# Altium schematic sheet LED´s_1Teclado.SchDoc
size A4
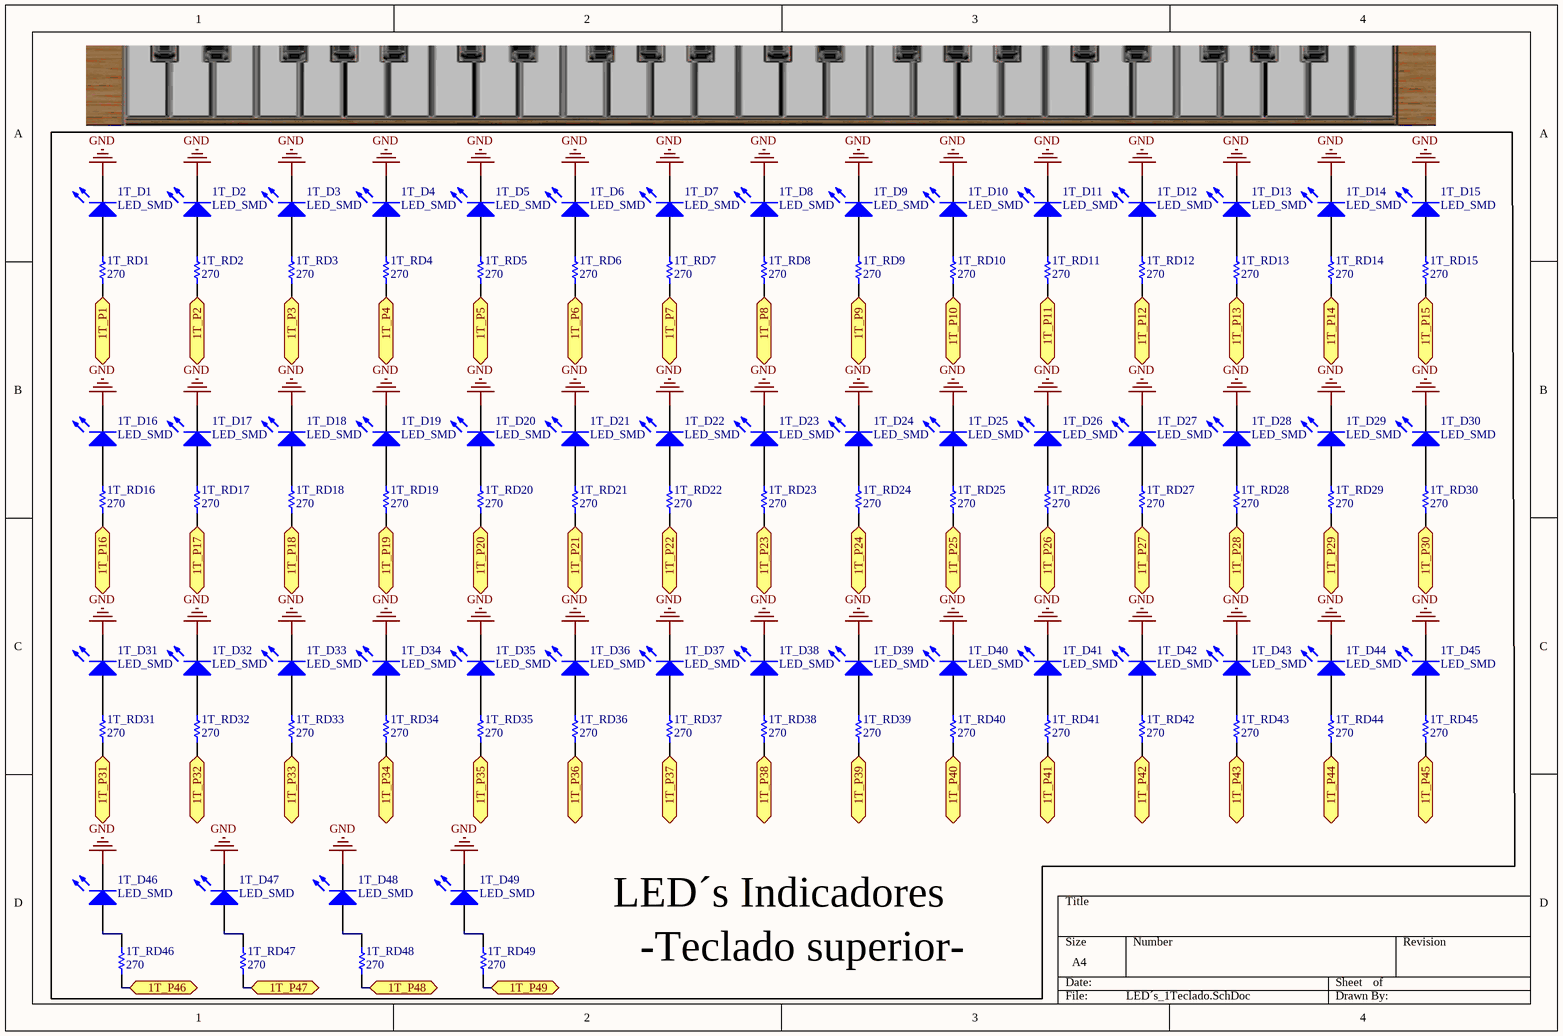
[diagram p0: LED´s_1Teclado.SchDoc]

## Parts
1T_D1  LED_SMD  [0805]
1T_D2  LED_SMD  [0805]
1T_D3  LED_SMD  [0805]
1T_D4  LED_SMD  [0805]
1T_D5  LED_SMD  [0805]
1T_D6  LED_SMD  [0805]
1T_D7  LED_SMD  [0805]
1T_D8  LED_SMD  [0805]
1T_D9  LED_SMD  [0805]
1T_D10  LED_SMD  [0805]
1T_D11  LED_SMD  [0805]
1T_D12  LED_SMD  [0805]
1T_D13  LED_SMD  [0805]
1T_D14  LED_SMD  [0805]
1T_D15  LED_SMD  [0805]
1T_D16  LED_SMD  [0805]
1T_D17  LED_SMD  [0805]
1T_D18  LED_SMD  [0805]
1T_D19  LED_SMD  [0805]
1T_D20  LED_SMD  [0805]
1T_D21  LED_SMD  [0805]
1T_D22  LED_SMD  [0805]
1T_D23  LED_SMD  [0805]
1T_D24  LED_SMD  [0805]
1T_D25  LED_SMD  [0805]
1T_D26  LED_SMD  [0805]
1T_D27  LED_SMD  [0805]
1T_D28  LED_SMD  [0805]
1T_D29  LED_SMD  [0805]
1T_D30  LED_SMD  [0805]
1T_D31  LED_SMD  [0805]
1T_D32  LED_SMD  [0805]
1T_D33  LED_SMD  [0805]
1T_D34  LED_SMD  [0805]
1T_D35  LED_SMD  [0805]
1T_D36  LED_SMD  [0805]
1T_D37  LED_SMD  [0805]
1T_D38  LED_SMD  [0805]
1T_D39  LED_SMD  [0805]
1T_D40  LED_SMD  [0805]
1T_D41  LED_SMD  [0805]
1T_D42  LED_SMD  [0805]
1T_D43  LED_SMD  [0805]
1T_D44  LED_SMD  [0805]
1T_D45  LED_SMD  [0805]
1T_D46  LED_SMD  [0805]
1T_D47  LED_SMD  [0805]
1T_D48  LED_SMD  [0805]
1T_D49  LED_SMD  [0805]
1T_RD1  value 270  [0805 Chip Res]  (hidden comment: Res Chip 0805)
1T_RD2  value 270  [0805 Chip Res]  (hidden comment: Res Chip 0805)
1T_RD3  value 270  [0805 Chip Res]  (hidden comment: Res Chip 0805)
1T_RD4  value 270  [0805 Chip Res]  (hidden comment: Res Chip 0805)
1T_RD5  value 270  [0805 Chip Res]  (hidden comment: Res Chip 0805)
1T_RD6  value 270  [0805 Chip Res]  (hidden comment: Res Chip 0805)
1T_RD7  value 270  [0805 Chip Res]  (hidden comment: Res Chip 0805)
1T_RD8  value 270  [0805 Chip Res]  (hidden comment: Res Chip 0805)
1T_RD9  value 270  [0805 Chip Res]  (hidden comment: Res Chip 0805)
1T_RD10  value 270  [0805 Chip Res]  (hidden comment: Res Chip 0805)
1T_RD11  value 270  [0805 Chip Res]  (hidden comment: Res Chip 0805)
1T_RD12  value 270  [0805 Chip Res]  (hidden comment: Res Chip 0805)
1T_RD13  value 270  [0805 Chip Res]  (hidden comment: Res Chip 0805)
1T_RD14  value 270  [0805 Chip Res]  (hidden comment: Res Chip 0805)
1T_RD15  value 270  [0805 Chip Res]  (hidden comment: Res Chip 0805)
1T_RD16  value 270  [0805 Chip Res]  (hidden comment: Res Chip 0805)
1T_RD17  value 270  [0805 Chip Res]  (hidden comment: Res Chip 0805)
1T_RD18  value 270  [0805 Chip Res]  (hidden comment: Res Chip 0805)
1T_RD19  value 270  [0805 Chip Res]  (hidden comment: Res Chip 0805)
1T_RD20  value 270  [0805 Chip Res]  (hidden comment: Res Chip 0805)
1T_RD21  value 270  [0805 Chip Res]  (hidden comment: Res Chip 0805)
1T_RD22  value 270  [0805 Chip Res]  (hidden comment: Res Chip 0805)
1T_RD23  value 270  [0805 Chip Res]  (hidden comment: Res Chip 0805)
1T_RD24  value 270  [0805 Chip Res]  (hidden comment: Res Chip 0805)
1T_RD25  value 270  [0805 Chip Res]  (hidden comment: Res Chip 0805)
1T_RD26  value 270  [0805 Chip Res]  (hidden comment: Res Chip 0805)
1T_RD27  value 270  [0805 Chip Res]  (hidden comment: Res Chip 0805)
1T_RD28  value 270  [0805 Chip Res]  (hidden comment: Res Chip 0805)
1T_RD29  value 270  [0805 Chip Res]  (hidden comment: Res Chip 0805)
1T_RD30  value 270  [0805 Chip Res]  (hidden comment: Res Chip 0805)
1T_RD31  value 270  [0805 Chip Res]  (hidden comment: Res Chip 0805)
1T_RD32  value 270  [0805 Chip Res]  (hidden comment: Res Chip 0805)
1T_RD33  value 270  [0805 Chip Res]  (hidden comment: Res Chip 0805)
1T_RD34  value 270  [0805 Chip Res]  (hidden comment: Res Chip 0805)
1T_RD35  value 270  [0805 Chip Res]  (hidden comment: Res Chip 0805)
1T_RD36  value 270  [0805 Chip Res]  (hidden comment: Res Chip 0805)
1T_RD37  value 270  [0805 Chip Res]  (hidden comment: Res Chip 0805)
1T_RD38  value 270  [0805 Chip Res]  (hidden comment: Res Chip 0805)
1T_RD39  value 270  [0805 Chip Res]  (hidden comment: Res Chip 0805)
1T_RD40  value 270  [0805 Chip Res]  (hidden comment: Res Chip 0805)
1T_RD41  value 270  [0805 Chip Res]  (hidden comment: Res Chip 0805)
1T_RD42  value 270  [0805 Chip Res]  (hidden comment: Res Chip 0805)
1T_RD43  value 270  [0805 Chip Res]  (hidden comment: Res Chip 0805)
1T_RD44  value 270  [0805 Chip Res]  (hidden comment: Res Chip 0805)
1T_RD45  value 270  [0805 Chip Res]  (hidden comment: Res Chip 0805)
1T_RD46  value 270  [0805 Chip Res]  (hidden comment: Res Chip 0805)
1T_RD47  value 270  [0805 Chip Res]  (hidden comment: Res Chip 0805)
1T_RD48  value 270  [0805 Chip Res]  (hidden comment: Res Chip 0805)
1T_RD49  value 270  [0805 Chip Res]  (hidden comment: Res Chip 0805)

## Ports
1T_P1, 1T_P2, 1T_P3, 1T_P4, 1T_P5, 1T_P6, 1T_P7, 1T_P8, 1T_P9, 1T_P10, 1T_P11, 1T_P12, 1T_P13, 1T_P14, 1T_P15, 1T_P16, 1T_P17, 1T_P18, 1T_P19, 1T_P20, 1T_P21, 1T_P22, 1T_P23, 1T_P24, 1T_P25, 1T_P26, 1T_P27, 1T_P28, 1T_P29, 1T_P30, 1T_P31, 1T_P32, 1T_P33, 1T_P34, 1T_P35, 1T_P36, 1T_P37, 1T_P38, 1T_P39, 1T_P40, 1T_P41, 1T_P42, 1T_P43, 1T_P44, 1T_P45, 1T_P46, 1T_P47, 1T_P48, 1T_P49

## Nets
GND: 1T_D1.2(K) 1T_D2.2(K) 1T_D3.2(K) 1T_D4.2(K) 1T_D5.2(K) 1T_D6.2(K) 1T_D7.2(K) 1T_D8.2(K) 1T_D9.2(K) 1T_D10.2(K) 1T_D11.2(K) 1T_D12.2(K) 1T_D13.2(K) 1T_D14.2(K) 1T_D15.2(K) 1T_D16.2(K) 1T_D17.2(K) 1T_D18.2(K) 1T_D19.2(K) 1T_D20.2(K) 1T_D21.2(K) 1T_D22.2(K) 1T_D23.2(K) 1T_D24.2(K) 1T_D25.2(K) 1T_D26.2(K) 1T_D27.2(K) 1T_D28.2(K) 1T_D29.2(K) 1T_D30.2(K) 1T_D31.2(K) 1T_D32.2(K) 1T_D33.2(K) 1T_D34.2(K) 1T_D35.2(K) 1T_D36.2(K) 1T_D37.2(K) 1T_D38.2(K) 1T_D39.2(K) 1T_D40.2(K) 1T_D41.2(K) 1T_D42.2(K) 1T_D43.2(K) 1T_D44.2(K) 1T_D45.2(K) 1T_D46.2(K) 1T_D47.2(K) 1T_D48.2(K) 1T_D49.2(K)
1T_P1: 1T_RD1.1 ; port 1T_P1
1T_P2: 1T_RD2.1 ; port 1T_P2
1T_P3: 1T_RD3.1 ; port 1T_P3
1T_P4: 1T_RD4.1 ; port 1T_P4
1T_P5: 1T_RD5.1 ; port 1T_P5
1T_P6: 1T_RD6.1 ; port 1T_P6
1T_P7: 1T_RD7.1 ; port 1T_P7
1T_P8: 1T_RD8.1 ; port 1T_P8
1T_P9: 1T_RD9.1 ; port 1T_P9
1T_P10: 1T_RD10.1 ; port 1T_P10
1T_P11: 1T_RD11.1 ; port 1T_P11
1T_P12: 1T_RD12.1 ; port 1T_P12
1T_P13: 1T_RD13.1 ; port 1T_P13
1T_P14: 1T_RD14.1 ; port 1T_P14
1T_P15: 1T_RD15.1 ; port 1T_P15
1T_P16: 1T_RD16.1 ; port 1T_P16
1T_P17: 1T_RD17.1 ; port 1T_P17
1T_P18: 1T_RD18.1 ; port 1T_P18
1T_P19: 1T_RD19.1 ; port 1T_P19
1T_P20: 1T_RD20.1 ; port 1T_P20
1T_P21: 1T_RD21.1 ; port 1T_P21
1T_P22: 1T_RD22.1 ; port 1T_P22
1T_P23: 1T_RD23.1 ; port 1T_P23
1T_P24: 1T_RD24.1 ; port 1T_P24
1T_P25: 1T_RD25.1 ; port 1T_P25
1T_P26: 1T_RD26.1 ; port 1T_P26
1T_P27: 1T_RD27.1 ; port 1T_P27
1T_P28: 1T_RD28.1 ; port 1T_P28
1T_P29: 1T_RD29.1 ; port 1T_P29
1T_P30: 1T_RD30.1 ; port 1T_P30
1T_P31: 1T_RD31.1 ; port 1T_P31
1T_P32: 1T_RD32.1 ; port 1T_P32
1T_P33: 1T_RD33.1 ; port 1T_P33
1T_P34: 1T_RD34.1 ; port 1T_P34
1T_P35: 1T_RD35.1 ; port 1T_P35
1T_P36: 1T_RD36.1 ; port 1T_P36
1T_P37: 1T_RD37.1 ; port 1T_P37
1T_P38: 1T_RD38.1 ; port 1T_P38
1T_P39: 1T_RD39.1 ; port 1T_P39
1T_P40: 1T_RD40.1 ; port 1T_P40
1T_P41: 1T_RD41.1 ; port 1T_P41
1T_P42: 1T_RD42.1 ; port 1T_P42
1T_P43: 1T_RD43.1 ; port 1T_P43
1T_P44: 1T_RD44.1 ; port 1T_P44
1T_P45: 1T_RD45.1 ; port 1T_P45
1T_P46: 1T_RD46.1 ; port 1T_P46
1T_P47: 1T_RD47.1 ; port 1T_P47
1T_P48: 1T_RD48.1 ; port 1T_P48
1T_P49: 1T_RD49.1 ; port 1T_P49
Net1T_D1_1: 1T_D1.1(A) 1T_RD1.2
Net1T_D2_1: 1T_D2.1(A) 1T_RD2.2
Net1T_D3_1: 1T_D3.1(A) 1T_RD3.2
Net1T_D4_1: 1T_D4.1(A) 1T_RD4.2
Net1T_D5_1: 1T_D5.1(A) 1T_RD5.2
Net1T_D6_1: 1T_D6.1(A) 1T_RD6.2
Net1T_D7_1: 1T_D7.1(A) 1T_RD7.2
Net1T_D8_1: 1T_D8.1(A) 1T_RD8.2
Net1T_D9_1: 1T_D9.1(A) 1T_RD9.2
Net1T_D10_1: 1T_D10.1(A) 1T_RD10.2
Net1T_D11_1: 1T_D11.1(A) 1T_RD11.2
Net1T_D12_1: 1T_D12.1(A) 1T_RD12.2
Net1T_D13_1: 1T_D13.1(A) 1T_RD13.2
Net1T_D14_1: 1T_D14.1(A) 1T_RD14.2
Net1T_D15_1: 1T_D15.1(A) 1T_RD15.2
Net1T_D16_1: 1T_D16.1(A) 1T_RD16.2
Net1T_D17_1: 1T_D17.1(A) 1T_RD17.2
Net1T_D18_1: 1T_D18.1(A) 1T_RD18.2
Net1T_D19_1: 1T_D19.1(A) 1T_RD19.2
Net1T_D20_1: 1T_D20.1(A) 1T_RD20.2
Net1T_D21_1: 1T_D21.1(A) 1T_RD21.2
Net1T_D22_1: 1T_D22.1(A) 1T_RD22.2
Net1T_D23_1: 1T_D23.1(A) 1T_RD23.2
Net1T_D24_1: 1T_D24.1(A) 1T_RD24.2
Net1T_D25_1: 1T_D25.1(A) 1T_RD25.2
Net1T_D26_1: 1T_D26.1(A) 1T_RD26.2
Net1T_D27_1: 1T_D27.1(A) 1T_RD27.2
Net1T_D28_1: 1T_D28.1(A) 1T_RD28.2
Net1T_D29_1: 1T_D29.1(A) 1T_RD29.2
Net1T_D30_1: 1T_D30.1(A) 1T_RD30.2
Net1T_D31_1: 1T_D31.1(A) 1T_RD31.2
Net1T_D32_1: 1T_D32.1(A) 1T_RD32.2
Net1T_D33_1: 1T_D33.1(A) 1T_RD33.2
Net1T_D34_1: 1T_D34.1(A) 1T_RD34.2
Net1T_D35_1: 1T_D35.1(A) 1T_RD35.2
Net1T_D36_1: 1T_D36.1(A) 1T_RD36.2
Net1T_D37_1: 1T_D37.1(A) 1T_RD37.2
Net1T_D38_1: 1T_D38.1(A) 1T_RD38.2
Net1T_D39_1: 1T_D39.1(A) 1T_RD39.2
Net1T_D40_1: 1T_D40.1(A) 1T_RD40.2
Net1T_D41_1: 1T_D41.1(A) 1T_RD41.2
Net1T_D42_1: 1T_D42.1(A) 1T_RD42.2
Net1T_D43_1: 1T_D43.1(A) 1T_RD43.2
Net1T_D44_1: 1T_D44.1(A) 1T_RD44.2
Net1T_D45_1: 1T_D45.1(A) 1T_RD45.2
Net1T_D46_1: 1T_D46.1(A) 1T_RD46.2
Net1T_D47_1: 1T_D47.1(A) 1T_RD47.2
Net1T_D48_1: 1T_D48.1(A) 1T_RD48.2
Net1T_D49_1: 1T_D49.1(A) 1T_RD49.2

## Notes on the sheet
- LED´s Indicadores
- -Teclado superior-

## Library data of the parts
1T_D1-1T_D49 = LED_SMD: LED SMD; Published: 8-Jun-2000; LatestRevisionDate: 08-Jul-2005; LatestRevisionNote: Mech Layer 1 removed.; PackageReference: LED-0; Publisher: Altium Limited
1T_RD1-1T_RD49 = Resistencia: Published: 8-Jun-2000; LatestRevisionDate: 17-Jul-2002; LatestRevisionNote: Re-released for DXP Platform.; PackageReference: AXIAL-0.3; Publisher: Altium Limited; PackageDescription: Axial Device, Thru-Hole; 2 Leads; 0.3 in Pin Spacing